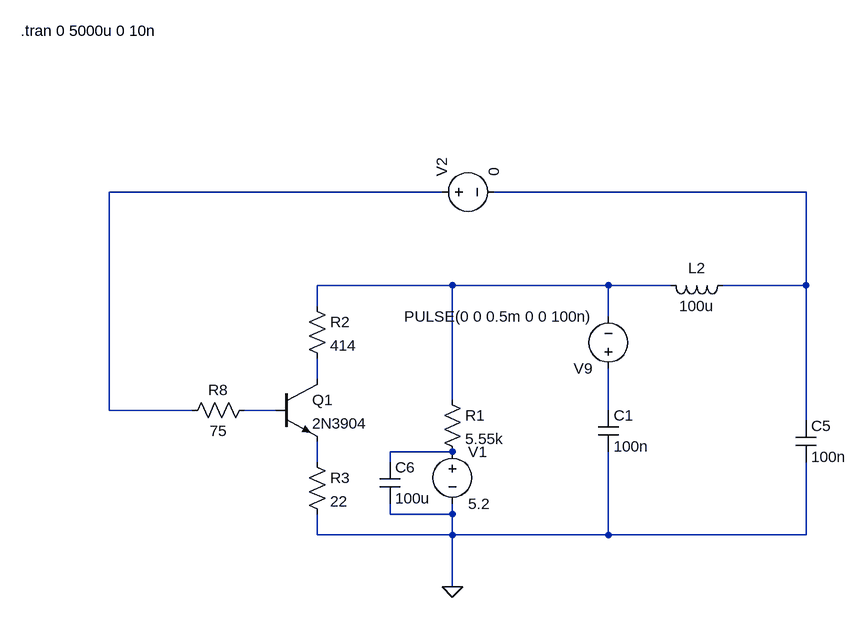
[diagram p0: schematic warmup_test.asc]
warmup_test.asc, the LTspice schematic file:
Version 4
SHEET 1 6864 680
WIRE 6000 -688 5488 -688
WIRE 6560 -688 6080 -688
WIRE 6016 -544 5808 -544
WIRE 6256 -544 6016 -544
WIRE 6352 -544 6256 -544
WIRE 6560 -544 6560 -688
WIRE 6560 -544 6432 -544
WIRE 5808 -512 5808 -544
WIRE 6256 -496 6256 -544
WIRE 5808 -400 5808 -432
WIRE 6016 -368 6016 -544
WIRE 5488 -352 5488 -688
WIRE 5616 -352 5488 -352
WIRE 5744 -352 5696 -352
WIRE 6256 -352 6256 -416
WIRE 6560 -336 6560 -544
WIRE 6016 -288 5920 -288
WIRE 5808 -272 5808 -304
WIRE 5920 -272 5920 -288
WIRE 5920 -192 5920 -208
WIRE 6016 -192 6016 -208
WIRE 6016 -192 5920 -192
WIRE 5808 -160 5808 -192
WIRE 6016 -160 6016 -192
WIRE 6016 -160 5808 -160
WIRE 6256 -160 6256 -288
WIRE 6256 -160 6016 -160
WIRE 6560 -160 6560 -272
WIRE 6560 -160 6256 -160
WIRE 6016 -80 6016 -160
FLAG 6016 -80 0
SYMBOL voltage 6016 -304 R0
WINDOW 123 0 0 Left 0
WINDOW 39 0 0 Left 0
SYMATTR InstName V1
SYMATTR Value 5.2
SYMBOL res 6000 -384 R0
SYMATTR InstName R1
SYMATTR Value 5.55k
SYMBOL cap 6240 -352 R0
SYMATTR InstName C1
SYMATTR Value 100n
SYMBOL cap 6544 -336 R0
SYMATTR InstName C5
SYMATTR Value 100n
SYMBOL ind 6448 -560 R90
WINDOW 0 5 56 VBottom 2
WINDOW 3 32 56 VTop 2
SYMATTR InstName L2
SYMATTR Value 100u
SYMATTR SpiceLine Rser=3.7
SYMBOL npn 5744 -400 R0
SYMATTR InstName Q1
SYMATTR Value 2N3904
SYMBOL voltage 5984 -688 R270
WINDOW 123 0 0 Left 0
WINDOW 39 0 0 Left 0
SYMATTR InstName V2
SYMATTR Value 0
SYMBOL cap 5904 -272 R0
SYMATTR InstName C6
SYMATTR Value 100u
SYMBOL voltage 6256 -400 R180
WINDOW 123 0 0 Left 0
WINDOW 39 0 0 Left 0
SYMATTR InstName V9
SYMATTR Value PULSE(0 0 0.5m 0 0 100n)
SYMBOL res 5792 -528 R0
SYMATTR InstName R2
SYMATTR Value 414
SYMBOL res 5792 -288 R0
SYMATTR InstName R3
SYMATTR Value 22
SYMBOL res 5712 -368 R90
WINDOW 0 0 56 VBottom 2
WINDOW 3 32 56 VTop 2
SYMATTR InstName R8
SYMATTR Value 75
TEXT 5352 -936 Left 2 !.tran 0 5000u 0 10n

The netlist it stands for:
* warmup_test.asc
V1 N007 0 5.2
R1 N003 N007 5.55k
C1 N006 0 100n
C5 N002 0 100n
L2 N002 N003 100u Rser=3.7
Q1 N004 N005 N008 0 2N3904
V2 N001 N002 0
C6 N007 0 100u
V9 N006 N003 PULSE(0 0 0.5m 0 0 100n)
R2 N003 N004 414
R3 N008 0 22
R8 N005 N001 75
.model NPN NPN
.model PNP PNP
.lib standard.bjt
.tran 0 5000u 0 10n
.backanno
.end